# Altium project PPE2.PrjPcb
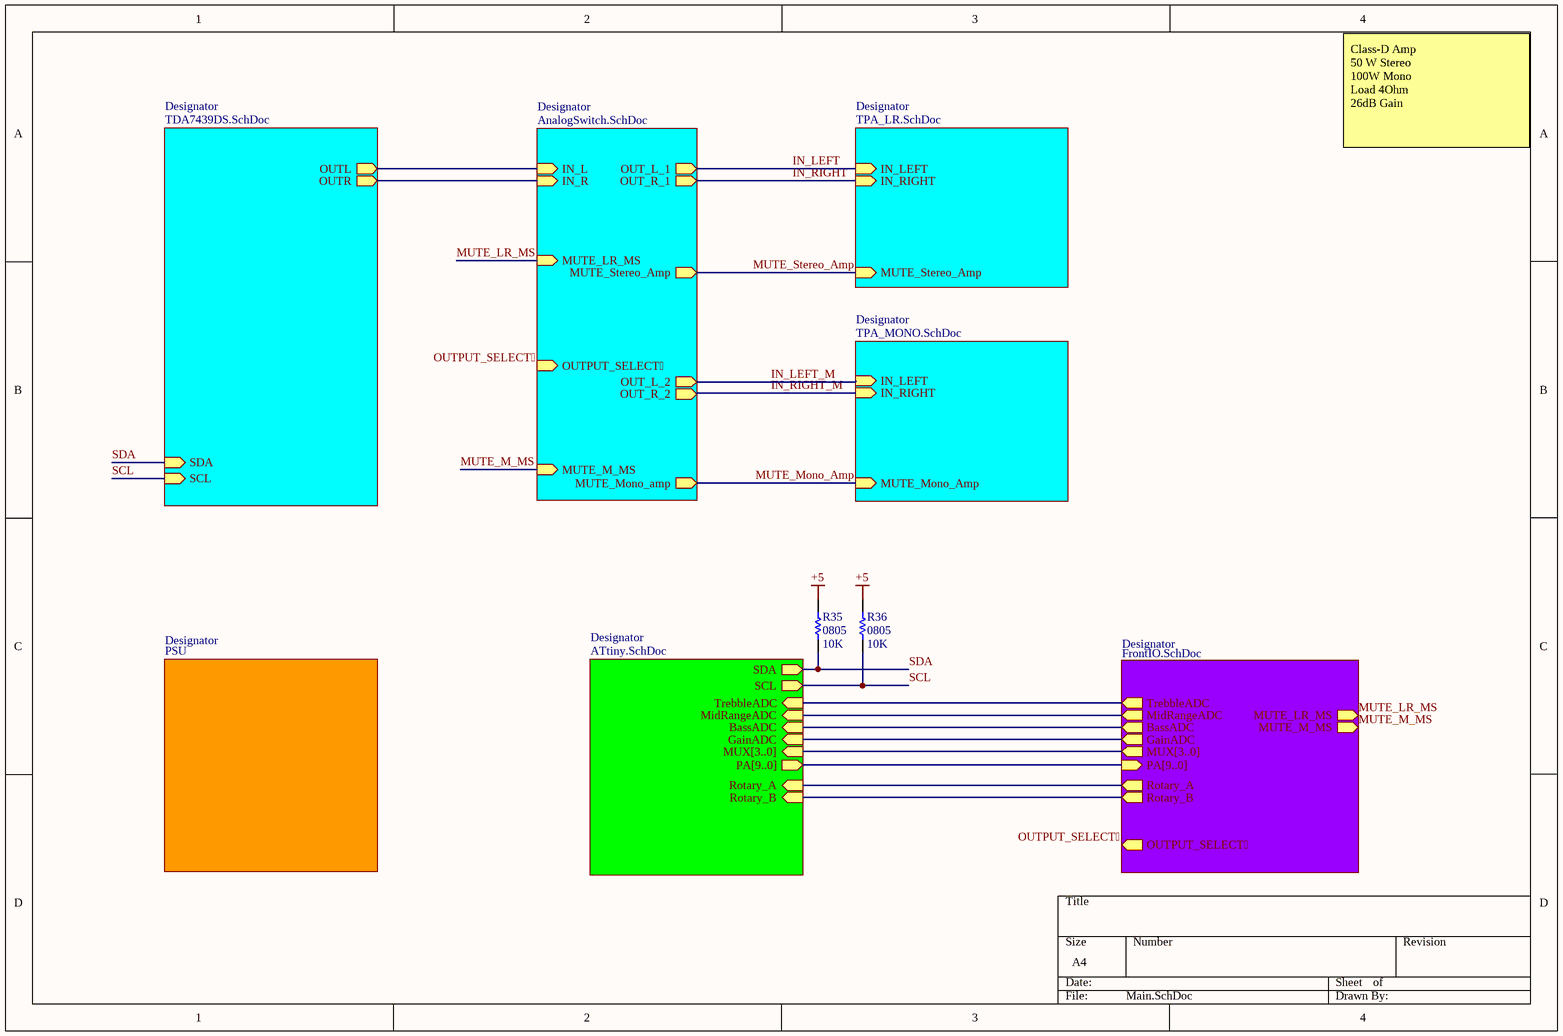
[diagram p0: Main.SchDoc]
8 sheets, 218 parts. Net scope: hierarchical (ports join the sheet entries above them; power ports are global).
Board file: PPE2.PcbDoc
Sheets:
  Main.SchDoc
    Designator = ATtiny.SchDoc
    Designator = TDA7439DS.SchDoc
    Designator = TPA_LR.SchDoc
    Designator = PSU.SchDoc
    Designator = FrontIO.SchDoc
    Designator = TPA_MONO.SchDoc
    Designator = AnalogSwitch.SchDoc

## Sheet Main.SchDoc
size A4; SheetNumber: 1; SheetTotal: 8

### Parts
R35  0805  value 10K  [6-0805_N]
R36  0805  value 10K  [6-0805_N]

### Sub-sheets
Designator = ATtiny.SchDoc: SDA (out), SCL (out), TrebbleADC (in), MidRangeADC (in), BassADC (in), GainADC (in), PA[9..0] (out), Rotary_A (in), Rotary_B (in), MUX[3..0] (in)
Designator = TDA7439DS.SchDoc: SDA (in), SCL (in), OUTL (out), OUTR (out)
Designator = TPA_LR.SchDoc: IN_LEFT (in), IN_RIGHT (in), MUTE_Stereo_Amp (in)
Designator = PSU: no entries
Designator = FrontIO.SchDoc: MidRangeADC (out), TrebbleADC (out), BassADC (out), GainADC (out), Rotary_A (out), Rotary_B (out), PA[9..0] (in), MUX[3..0] (out), MUTE_LR_MS (out), MUTE_M_MS (out), OUTPUT_SELECT (out)
Designator = TPA_MONO.SchDoc: IN_LEFT (in), IN_RIGHT (in), MUTE_Mono_Amp (in)
Designator = AnalogSwitch.SchDoc: IN_L (in), IN_R (in), OUT_L_1 (out), OUT_L_2 (out), OUT_R_1 (out), OUT_R_2 (out), OUTPUT_SELECT (in), MUTE_LR_MS (in), MUTE_M_MS (in), MUTE_Mono_amp (out), MUTE_Stereo_Amp (out)

### Nets
+5: R35.2 R36.2  [project net 5V]
BassADC: sheet Designator/BassADC, sheet Designator/BassADC
GainADC: sheet Designator/GainADC, sheet Designator/GainADC
IN_L: sheet Designator/OUTL, sheet Designator/IN_L
IN_LEFT: sheet Designator/IN_LEFT, sheet Designator/OUT_L_1
IN_LEFT_M: sheet Designator/IN_LEFT, sheet Designator/OUT_L_2
IN_R: sheet Designator/OUTR, sheet Designator/IN_R
IN_RIGHT: sheet Designator/IN_RIGHT, sheet Designator/OUT_R_1
IN_RIGHT_M: sheet Designator/IN_RIGHT, sheet Designator/OUT_R_2
MidRangeADC: sheet Designator/MidRangeADC, sheet Designator/MidRangeADC
MUTE_LR_MS: sheet Designator/MUTE_LR_MS, sheet Designator/MUTE_LR_MS
MUTE_M_MS: sheet Designator/MUTE_M_MS, sheet Designator/MUTE_M_MS
MUTE_Mono_Amp: sheet Designator/MUTE_Mono_Amp, sheet Designator/MUTE_Mono_amp  [project net MUTE_M]
MUTE_Stereo_Amp: sheet Designator/MUTE_Stereo_Amp, sheet Designator/MUTE_Stereo_Amp  [project net MUTE]
OUTPUT_SELECT: sheet Designator/OUTPUT_SELECT, sheet Designator/OUTPUT_SELECT
Rotary_N: sheet Designator/Rotary_B, sheet Designator/Rotary_B
Rotary_P: sheet Designator/Rotary_A, sheet Designator/Rotary_A
SCL: R36.1 ; sheet Designator/SCL, sheet Designator/SCL
SDA: R35.1 ; sheet Designator/SDA, sheet Designator/SDA
TrebbleADC: sheet Designator/TrebbleADC, sheet Designator/TrebbleADC

### Notes on the sheet
- Class-D Amp
  50 W Stereo
  100W Mono
  Load 4Ohm
  26dB Gain

### Library data of the parts
R35 R36 = Res1: Resistor; Published: 8-Jun-2000; LatestRevisionDate: 17-Jul-2002; LatestRevisionNote: Re-released for DXP Platform.; PackageReference: AXIAL-0.3; Publisher: Altium Limited; PackageDescription: Axial Device, Thru-Hole; 2 Leads; 0.3 in Pin Spacing

## Sheet ATtiny.SchDoc
size A4; SheetNumber: 2; SheetTotal: 8
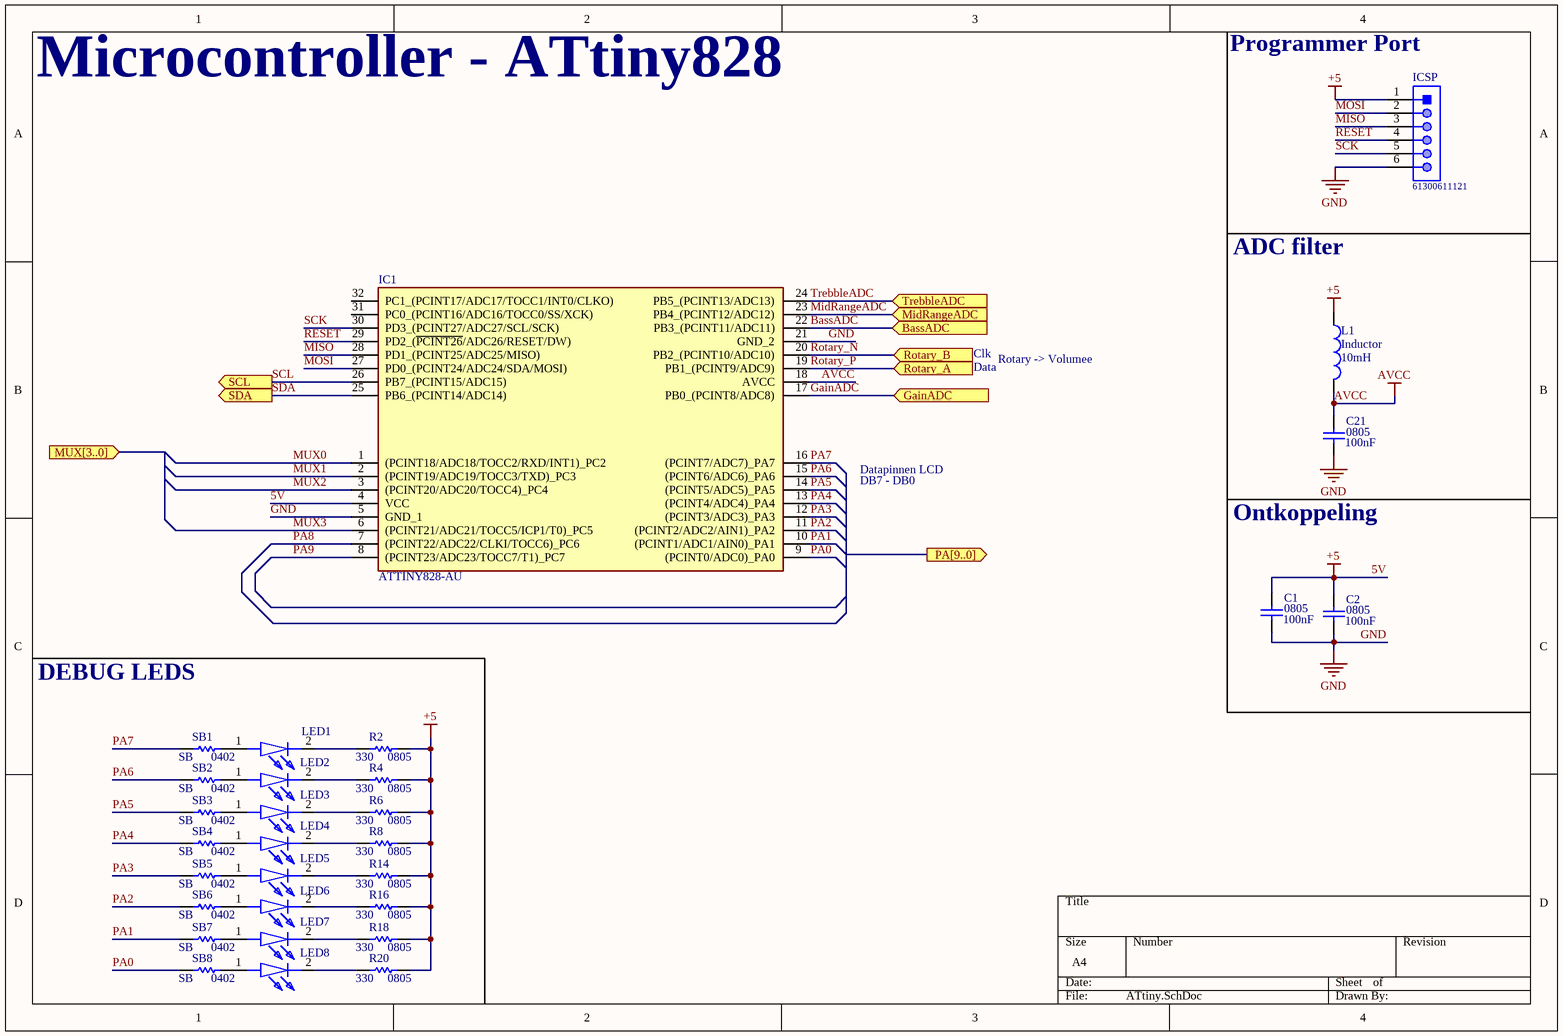
[diagram p1: ATtiny.SchDoc]

### Parts
C1  0805  value 100nF  [6-0805_N]
C2  0805  value 100nF  [6-0805_N]
C21  0805  value 100nF  [6-0805_N]
IC1  ATTINY828-AU  [QFP80P900X900X120-32N]
ICSP  61300611121  [61300611121]
L1  Inductor  value 10mH  [2220]
LED1  ELM70303GD  [ELM70303GD]  (value not drawn)
LED2  ELM70303GD  [ELM70303GD]  (value not drawn)
LED3  ELM70303GD  [ELM70303GD]  (value not drawn)
LED4  ELM70303GD  [ELM70303GD]  (value not drawn)
LED5  ELM70303GD  [ELM70303GD]  (value not drawn)
LED6  ELM70303GD  [ELM70303GD]  (value not drawn)
LED7  ELM70303GD  [ELM70303GD]  (value not drawn)
LED8  ELM70303GD  [ELM70303GD]  (value not drawn)
R2  0805  value 330  [6-0805_N]
R4  0805  value 330  [6-0805_N]
R6  0805  value 330  [6-0805_N]
R8  0805  value 330  [6-0805_N]
R14  0805  value 330  [6-0805_N]
R16  0805  value 330  [6-0805_N]
R18  0805  value 330  [6-0805_N]
R20  0805  value 330  [6-0805_N]
SB1  0402  value SB  [0402]
SB2  0402  value SB  [0402]
SB3  0402  value SB  [0402]
SB4  0402  value SB  [0402]
SB5  0402  value SB  [0402]
SB6  0402  value SB  [0402]
SB7  0402  value SB  [0402]
SB8  0402  value SB  [0402]

### Ports
BassADC (in, see Main[3C], FrontIO[4A]), GainADC (in, see Main[3C], FrontIO[4B]), MidRangeADC (in, see Main[3C], FrontIO[4A]), MUX[3..0] (in, see Main[3C], FrontIO[2A]), PA[9..0] (out, see Main[3C], FrontIO[1B]), Rotary_A (in, see Main[3D], FrontIO[3B]), Rotary_B (in, see Main[3D], FrontIO[3B]), SCL (out, see Main[3C], TDA7439DS[2B]), SDA (out, see Main[3C], TDA7439DS[2B]), TrebbleADC (in, see Main[3C], FrontIO[3A])

### Nets
5V: C1.1 C2.1 IC1.4(VCC) ICSP.1 L1.1 R2.1 R4.1 R6.1 R8.1 R14.1 R16.1 R18.1 R20.1  [also labelled +5]
AVCC: C21.1 IC1.18(AVCC) L1.2
GND: C1.2 C2.2 C21.2 IC1.5(GND_1) IC1.21(GND_2) ICSP.6
BassADC: IC1.22(PB3_(PCINT11/ADC11)) ; port BassADC
GainADC: IC1.17(PB0_(PCINT8/ADC8)) ; port GainADC
MidRangeADC: IC1.23(PB4_(PCINT12/ADC12)) ; port MidRangeADC
MISO: IC1.28(PD1_(PCINT25/ADC25/MISO)) ICSP.3
MOSI: IC1.27(PD0_(PCINT24/ADC24/SDA/MOSI)) ICSP.2
MUX0: IC1.1((PCINT18/ADC18/TOCC2/RXD/INT1)_PC2)
MUX1: IC1.2((PCINT19/ADC19/TOCC3/TXD)_PC3)
MUX2: IC1.3((PCINT20/ADC20/TOCC4)_PC4)
MUX3: IC1.6((PCINT21/ADC21/TOCC5/ICP1/T0)_PC5)
PA0: IC1.9((PCINT0/ADC0)_PA0) SB8.2
PA1: IC1.10((PCINT1/ADC1/AIN0)_PA1) SB7.2
PA2: IC1.11((PCINT2/ADC2/AIN1)_PA2) SB6.2
PA3: IC1.12((PCINT3/ADC3)_PA3) SB5.2
PA4: IC1.13((PCINT4/ADC4)_PA4) SB4.2
PA5: IC1.14((PCINT5/ADC5)_PA5) SB3.2
PA6: IC1.15((PCINT6/ADC6)_PA6) SB2.2
PA7: IC1.16((PCINT7/ADC7)_PA7) SB1.2
PA8: IC1.7((PCINT22/ADC22/CLKI/TOCC6)_PC6)
PA9: IC1.8((PCINT23/ADC23/TOCC7/T1)_PC7)
RESET: IC1.29(PD2_(~{PCINT26}/ADC26/RESET/DW)) ICSP.4
Rotary_N: IC1.20(PB2_(PCINT10/ADC10)) ; port Rotary_B
Rotary_P: IC1.19(PB1_(PCINT9/ADC9)) ; port Rotary_A
SCK: IC1.30(PD3_(PCINT27/ADC27/SCL/SCK)) ICSP.5
SCL: IC1.26(PB7_(PCINT15/ADC15)) ; port SCL
SDA: IC1.25(PB6_(PCINT14/ADC14)) ; port SDA
TrebbleADC: IC1.24(PB5_(PCINT13/ADC13)) ; port TrebbleADC
NetLED1_1: LED1.1(A) SB1.1
NetLED1_2: LED1.2(K) R2.2
NetLED2_1: LED2.1(A) SB2.1
NetLED2_2: LED2.2(K) R4.2
NetLED3_1: LED3.1(A) SB3.1
NetLED3_2: LED3.2(K) R6.2
NetLED4_1: LED4.1(A) SB4.1
NetLED4_2: LED4.2(K) R8.2
NetLED5_1: LED5.1(A) SB5.1
NetLED5_2: LED5.2(K) R14.2
NetLED6_1: LED6.1(A) SB6.1
NetLED6_2: LED6.2(K) R16.2
NetLED7_1: LED7.1(A) SB7.1
NetLED7_2: LED7.2(K) R18.2
NetLED8_1: LED8.1(A) SB8.1
NetLED8_2: LED8.2(K) R20.2

Not connected (* = marked no-connect by the designer): IC1 31(PC0_(PCINT16/ADC16/TOCC0/SS/XCK)) 32(PC1_(PCINT17/ADC17/TOCC1/INT0/CLKO))

### Notes on the sheet
- Microcontroller - ATtiny828
- (near ICSP) Programmer Port
- ADC filter
- Clk
- Data <Clk>
- Rotary -> Volumee
- Datapinnen LCD
- DB7 - DB0
- Ontkoppeling
- DEBUG LEDS

### Library data of the parts
C1 C2 C21 = Cap: Capacitor; Published: 8-Jun-2000; LatestRevisionDate: 17-Jul-2002; LatestRevisionNote: Re-released for DXP Platform.; PackageReference: RAD-0.3; Publisher: Altium Limited; PackageDescription: Radial Cap, Thru-Hole; 2 Leads; 0.3 in Pin Spacing
IC1 = ATTINY828-AU: Integrated Circuit; Manufacturer_Name: Microchip; Datasheet Link: http://ww1.microchip.com/downloads/en/DeviceDoc/doc8371.pdf; Height: 1.2mm; Manufacturer_Part_Number: ATTINY828-AU
ICSP = CMP-1502-01070-1: THT Vertical Pin Header WR-PHD, Pitch 2.54 mm, Single Row, 6 pins; Manufacturer: Wurth Elektronik; Gender: Male; Pin Number: 6; Pitch: 2.54mm; Working Voltage: 250VAC; Rated Current: 3A; Withstanding Voltage: 500VAC; Contact Resistance: 20mOhm; Operating Temperature: -40to105degC; Packaging: Bag; Datasheet URL: https://katalog.we-online.de/em/datasheet/6130xx11121.pdf; Package Reference: 61300611121; Mounting Technology: THT; Publisher: WurthElektronik; Part Number: 61300611121; Manufacturer URL: http://www.we-online.de; Row Number: Single; Orientation: Vertical
L1 = Inductor: Code_IEC: 1005; Published: 8-Jun-2000; LatestRevisionDate: 29-May-2009; LatestRevisionNote: IPC-7351 Footprint Added.; PackageReference: 0402-A; Publisher: Altium Limited; PackageDescription: Chip Inductor; Code_JEITA: 0402
LED1-LED8 = ELM70303GD: LED; Manufacturer_Name: Bivar; Datasheet Link: https://componentsearchengine.com/Datasheets/2/ELM70303GD.pdf; Height: 5.4mm; Manufacturer_Part_Number: ELM70303GD; Mouser Part Number: 749-ELM70303GD; Mouser Price/Stock: https://www.mouser.co.uk/ProductDetail/Bivar/ELM70303GD?qs=RaByzyhmEWg099B9bvH9wg%3D%3D
R2 R4 R6 R8 R14 R16 R18 R20 SB1-SB8 = Res1: Resistor; Published: 8-Jun-2000; LatestRevisionDate: 17-Jul-2002; LatestRevisionNote: Re-released for DXP Platform.; PackageReference: AXIAL-0.3; Publisher: Altium Limited; PackageDescription: Axial Device, Thru-Hole; 2 Leads; 0.3 in Pin Spacing

## Sheet TDA7439DS.SchDoc
size A4; SheetNumber: 3; SheetTotal: 8
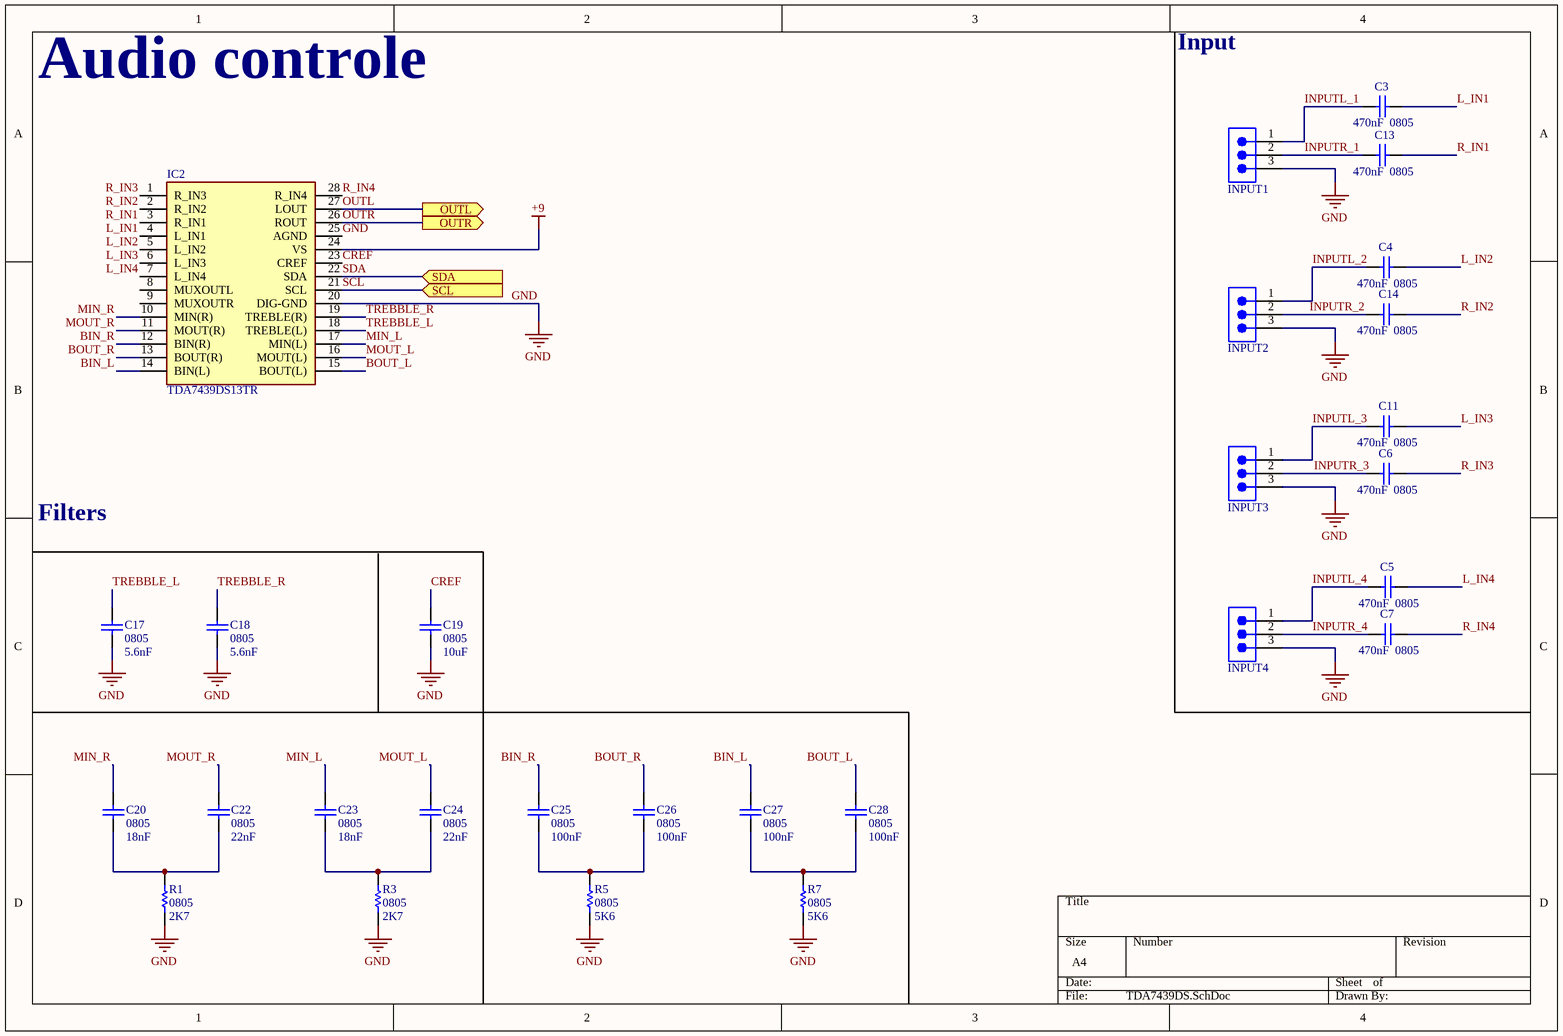
[diagram p2: TDA7439DS.SchDoc]

### Parts
C3  0805  value 470nF  [6-0805_N]
C4  0805  value 470nF  [6-0805_N]
C5  0805  value 470nF  [6-0805_N]
C6  0805  value 470nF  [6-0805_N]
C7  0805  value 470nF  [6-0805_N]
C11  0805  value 470nF  [6-0805_N]
C13  0805  value 470nF  [6-0805_N]
C14  0805  value 470nF  [6-0805_N]
C17  0805  value 5.6nF  [6-0805_N]
C18  0805  value 5.6nF  [6-0805_N]
C19  0805  value 10uF  [6-0805_N]
C20  0805  value 18nF  [6-0805_N]
C22  0805  value 22nF  [6-0805_N]
C23  0805  value 18nF  [6-0805_N]
C24  0805  value 22nF  [6-0805_N]
C25  0805  value 100nF  [6-0805_N]
C26  0805  value 100nF  [6-0805_N]
C27  0805  value 100nF  [6-0805_N]
C28  0805  value 100nF  [6-0805_N]
IC2  TDA7439DS13TR  [SOIC127P1032X265-28N]
INPUT1  TSW-103-07-F-S  [SMTC-TSW-103-07-X-S]  (value not drawn)
INPUT2  TSW-103-07-F-S  [SMTC-TSW-103-07-X-S]  (value not drawn)
INPUT3  TSW-103-07-F-S  [SMTC-TSW-103-07-X-S]  (value not drawn)
INPUT4  TSW-103-07-F-S  [SMTC-TSW-103-07-X-S]  (value not drawn)
R1  0805  value 2K7  [6-0805_N]
R3  0805  value 2K7  [6-0805_N]
R5  0805  value 5K6  [6-0805_N]
R7  0805  value 5K6  [6-0805_N]

### Ports
OUTL (out, see Main[1A]), OUTR (out, see Main[1A]), SCL (in, see Main[1B], ATtiny[1B]), SDA (in, see Main[1B], ATtiny[1B])

### Nets
+9: IC2.24(VS)
GND: C17.2 C18.2 C19.2 IC2.20(DIG-GND) IC2.25(AGND) INPUT1.3 INPUT2.3 INPUT3.3 INPUT4.3 R1.1 R3.1 R5.1 R7.1
BIN_L: C27.1 IC2.14(BIN(L))
BIN_R: C25.1 IC2.12(BIN(R))
BOUT_L: C28.1 IC2.15(BOUT(L))
BOUT_R: C26.1 IC2.13(BOUT(R))
CREF: C19.1 IC2.23(CREF)
INPUTL_1: C3.1 INPUT1.1
INPUTL_2: C4.1 INPUT2.1
INPUTL_3: C11.1 INPUT3.1
INPUTL_4: C5.1 INPUT4.1
INPUTR_1: C13.1 INPUT1.2
INPUTR_2: C14.1 INPUT2.2
INPUTR_3: C6.1 INPUT3.2
INPUTR_4: C7.1 INPUT4.2
L_IN1: C3.2 IC2.4(L_IN1)
L_IN2: C4.2 IC2.5(L_IN2)
L_IN3: C11.2 IC2.6(L_IN3)
L_IN4: C5.2 IC2.7(L_IN4)
MIN_L: C23.1 IC2.17(MIN(L))
MIN_R: C20.1 IC2.10(MIN(R))
MOUT_L: C24.1 IC2.16(MOUT(L))
MOUT_R: C22.1 IC2.11(MOUT(R))
OUTL: IC2.27(LOUT) ; port OUTL  [project net IN_L]
OUTR: IC2.26(ROUT) ; port OUTR  [project net IN_R]
R_IN1: C13.2 IC2.3(R_IN1)
R_IN2: C14.2 IC2.2(R_IN2)
R_IN3: C6.2 IC2.1(R_IN3)
R_IN4: C7.2 IC2.28(R_IN4)
SCL: IC2.21(SCL) ; port SCL
SDA: IC2.22(SDA) ; port SDA
TREBBLE_L: C17.1 IC2.18(TREBLE(L))
TREBBLE_R: C18.1 IC2.19(TREBLE(R))
NetC20_2: C20.2 C22.2 R1.2
NetC23_2: C23.2 C24.2 R3.2
NetC25_2: C25.2 C26.2 R5.2
NetC27_2: C27.2 C28.2 R7.2

Not connected (* = marked no-connect by the designer): IC2 8(MUXOUTL) 9(MUXOUTR)

### Notes on the sheet
- Audio controle
- Input
- Filters

### Library data of the parts
C3-C7 C11 C13 C14 C17-C20 C22-C28 = Cap: Capacitor; Published: 8-Jun-2000; LatestRevisionDate: 17-Jul-2002; LatestRevisionNote: Re-released for DXP Platform.; PackageReference: RAD-0.3; Publisher: Altium Limited; PackageDescription: Radial Cap, Thru-Hole; 2 Leads; 0.3 in Pin Spacing
IC2 = TDA7439DS13TR: Integrated Circuit; Manufacturer_Name: STMicroelectronics; Datasheet Link: https://componentsearchengine.com//TDA7439DS13TR.pdf; Height: 2.65mm; Mouser2 Part Number: 511-TDA7439DS13TR; Mouser2 Price/Stock: https://www.mouser.com/Search/Refine.aspx?Keyword=511-TDA7439DS13TR; Manufacturer_Part_Number: TDA7439DS13TR
INPUT1-INPUT4 = CMP-1024-00331-1: 0.025" SQ Post Header, Through-hole, Vertical, -55 to 125 degC, 2.54 mm Pitch, 3-Pin, Male, RoHS; Manufacturer: Samtec; Pitch: 2.54 mm; DatasheetVersion: F-214; ComponentLink1Description: Manufacturer URL; ComponentLink3URL: http://www.samtec.com/documents/webfiles/cpdf/TSW-XXX-XX-XXX-X-XX-XXX-MKT.pdf; Mounting Technology: Through-hole; PackageDescription: .025[0.64] SQ. Post Terminal Strip Assembly; Temperature Range: -55 to 125 degC; ComponentLink3Description: Package Specification; Orientation: Vertical; PartNumber: TSW-103-07-F-S; RoHS: True; PackageVersion: DM, 8/1988; ComponentLink2Description: Datasheet; ComponentLink1URL: http://www.samtec.com; ComponentLink2URL: http://www.samtec.com/documents/webfiles/pdf/TSW_TH.PDF; PackageReference: TSW-103-07-X-S
R1 R3 R5 R7 = Res1: Resistor; Published: 8-Jun-2000; LatestRevisionDate: 17-Jul-2002; LatestRevisionNote: Re-released for DXP Platform.; PackageReference: AXIAL-0.3; Publisher: Altium Limited; PackageDescription: Axial Device, Thru-Hole; 2 Leads; 0.3 in Pin Spacing

## Sheet TPA_LR.SchDoc
size A4; SheetNumber: 4; SheetTotal: 8
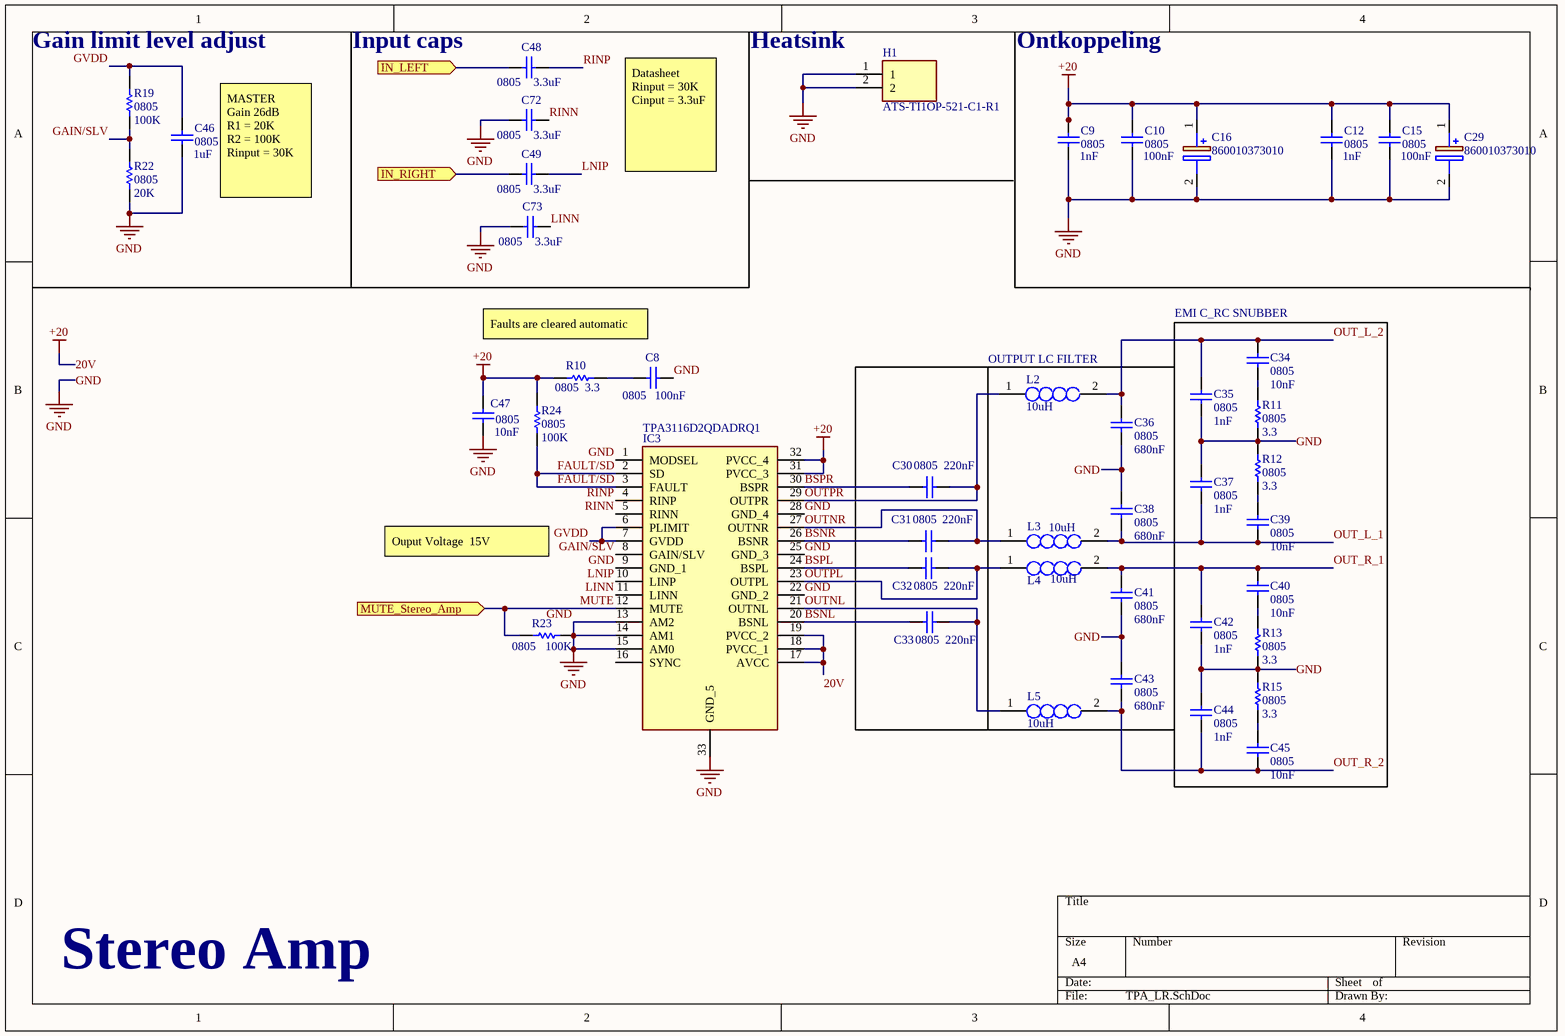
[diagram p3: TPA_LR.SchDoc]

### Parts
C8  0805  value 100nF  [6-0805_N]
C9  0805  value 1nF  [6-0805_N]
C10  0805  value 100nF  [6-0805_N]
C12  0805  value 1nF  [6-0805_N]
C15  0805  value 100nF  [6-0805_N]
C16  860010373010  [CAPPRD250W52D630H1250]
C29  860010373010  [CAPPRD250W52D630H1250]
C30  0805  value 220nF  [6-0805_N]
C31  0805  value 220nF  [6-0805_N]
C32  0805  value 220nF  [6-0805_N]
C33  0805  value 220nF  [6-0805_N]
C34  0805  value 10nF  [6-0805_N]
C35  0805  value 1nF  [6-0805_N]
C36  0805  value 680nF  [6-0805_N]
C37  0805  value 1nF  [6-0805_N]
C38  0805  value 680nF  [6-0805_N]
C39  0805  value 10nF  [6-0805_N]
C40  0805  value 10nF  [6-0805_N]
C41  0805  value 680nF  [6-0805_N]
C42  0805  value 1nF  [6-0805_N]
C43  0805  value 680nF  [6-0805_N]
C44  0805  value 1nF  [6-0805_N]
C45  0805  value 10nF  [6-0805_N]
C46  0805  value 1uF  [6-0805_N]
C47  0805  value 10nF  [6-0805_N]
C48  0805  value 3.3uF  [6-0805_N]
C49  0805  value 3.3uF  [6-0805_N]
C72  0805  value 3.3uF  [6-0805_N]
C73  0805  value 3.3uF  [6-0805_N]
H1  ATS-TI1OP-521-C1-R1  [ATSTI1OP521C1R1]
IC3  TPA3116D2QDADRQ1  [SOP65P810X120-33N]
L2  10uH  [INDPM110100X400N]
L3  10uH  [INDPM110100X400N]
L4  10uH  [INDPM110100X400N]
L5  10uH  [INDPM110100X400N]
R10  0805  value 3.3  [6-0805_N]
R11  0805  value 3.3  [6-0805_N]
R12  0805  value 3.3  [6-0805_N]
R13  0805  value 3.3  [6-0805_N]
R15  0805  value 3.3  [6-0805_N]
R19  0805  value 100K  [6-0805_N]
R22  0805  value 20K  [6-0805_N]
R23  0805  value 100K  [6-0805_N]
R24  0805  value 100K  [6-0805_N]

### Blocks framed on the sheet
EMI C_RC SNUBBER: C34 C35 C37 C39 C40 C42 C44 C45 R11-R13 R15
OUTPUT LC FILTER: C30-C33

### Ports
IN_LEFT (in, see Main[3A]), IN_RIGHT (in, see Main[3A]), MUTE_Stereo_Amp (in, see Main[3B], AnalogSwitch[3B])

### Nets
20V: C9.1 C10.1 C12.1 C15.1 C16.1(+) C29.1(+) C47.1 IC3.17(AVCC) IC3.18(PVCC_1) IC3.19(PVCC_2) IC3.31(PVCC_3) IC3.32(PVCC_4) R10.2 R24.2  [also labelled +20]
GND: C8.2 C9.2 C10.2 C12.2 C15.2 C16.2(-) C29.2(-) C35.1 C36.1 C37.2 C38.2 C41.1 C42.1 C43.2 C44.2 C46.2 C47.2 C72.1 C73.1 H1.1 H1.2 IC3.1(MODSEL) IC3.9(GND_1) IC3.13(AM2) IC3.14(AM1) IC3.15(AM0) IC3.22(GND_2) IC3.25(GND_3) IC3.28(GND_4) IC3.33(GND_5) R11.1 R12.2 R13.1 R15.2 R22.1 R23.1
BSNL: C33.1 IC3.20(BSNL)
BSNR: C31.1 IC3.26(BSNR)
BSPL: C32.1 IC3.24(BSPL)
BSPR: C30.1 IC3.30(BSPR)
FAULT/SD: IC3.2(SD) IC3.3(FAULT) R24.1
GAIN/SLV: IC3.8(GAIN/SLV) R19.1 R22.2
GVDD: C46.1 IC3.6(PLIMIT) IC3.7(GVDD) R19.2
IN_LEFT: C48.1 ; port IN_LEFT
IN_RIGHT: C49.1 ; port IN_RIGHT
LINN: C73.2 IC3.11(LINN)
LNIP: C49.2 IC3.10(LINP)
MUTE: IC3.12(MUTE) R23.2 ; port MUTE_Stereo_Amp
OUT_L_1: C37.1 C38.1 C39.1 L3.2
OUT_L_2: C34.2 C35.2 C36.2 L2.2
OUT_R_1: C40.2 C41.2 C42.2 L4.2
OUT_R_2: C43.1 C44.1 C45.1 L5.2
OUTNL: C33.2 IC3.21(OUTNL) L5.1
OUTNR: C31.2 IC3.27(OUTNR) L3.1
OUTPL: C32.2 IC3.23(OUTPL) L4.1
OUTPR: C30.2 IC3.29(OUTPR) L2.1
RINN: C72.2 IC3.5(RINN)
RINP: C48.2 IC3.4(RINP)
NetC8_1: C8.1 R10.1
NetC34_1: C34.1 R11.2
NetC39_2: C39.2 R12.1
NetC40_1: C40.1 R13.2
NetC45_2: C45.2 R15.1

Not connected (* = marked no-connect by the designer): IC3 16(SYNC)

### Notes on the sheet
- (near R19) Gain limit level adjust
- (near C48) Input caps
- (near H1) Heatsink
- Ontkoppeling
- Datasheet
  Rinput = 30K
  Cinput = 3.3uF
- (near C46) MASTER
  Gain 26dB
  R1 = 20K
  R2 = 100K
  Rinput = 30K
- Faults are cleared automatic
- Ouput Voltage  15V
- Stereo Amp

### Library data of the parts
C8-C10 C12 C15 C30-C49 C72 C73 = Cap: Capacitor; Published: 8-Jun-2000; LatestRevisionDate: 17-Jul-2002; LatestRevisionNote: Re-released for DXP Platform.; PackageReference: RAD-0.3; Publisher: Altium Limited; PackageDescription: Radial Cap, Thru-Hole; 2 Leads; 0.3 in Pin Spacing
C16 C29 = 860010373010: Capacitor Polarised; Manufacturer_Name: Wurth Elektronik; Datasheet Link: https://ms.componentsearchengine.com/Datasheets/2/860010373010.pdf; Height: 12.5mm; Manufacturer_Part_Number: 860010373010; Mouser Part Number: 710-860010373010; Mouser Price/Stock: https://www.mouser.com/Search/Refine.aspx?Keyword=710-860010373010
H1 = ATS-TI1OP-521-C1-R1: Hardware; Manufacturer_Name: ADVANCED THERMAL SOLUTIONS; Datasheet Link: https://media.digikey.com/pdf/Data%20Sheets/Advanced%20Thermal%20Solutions%20PDFs/ATS-TI10P-521-C1-R1.pdf; Height: 28mm; Manufacturer_Part_Number: ATS-TI1OP-521-C1-R1; Mouser Part Number: 984-ATS-TI1OP521C1R1; Mouser Price/Stock: https://www.mouser.co.uk/ProductDetail/Advanced-Thermal-Solutions/ATS-TI1OP-521-C1-R1?qs=MLItCLRbWsx43HjcCreTeQ%3D%3D; Arrow Part Number: ATS-TI1OP-521-C1-R1; Arrow Price/Stock: https://www.arrow.com/en/products/ats-ti1op-521-c1-r1/advanced-thermal-solutions?region=europe
IC3 = TPA3116D2QDADRQ1: Integrated Circuit; Manufacturer_Name: Texas Instruments; Datasheet Link: http://www.ti.com/lit/gpn/tpa3116d2-q1; Height: 1.2mm; Manufacturer_Part_Number: TPA3116D2QDADRQ1; Mouser Part Number: 595-TPA3116D2QDADRQ1; Mouser Price/Stock: https://www.mouser.co.uk/ProductDetail/Texas-Instruments/TPA3116D2QDADRQ1?qs=UPLqB4C8V4HphPtdRa3LzQ%3D%3D; Arrow Part Number: TPA3116D2QDADRQ1; Arrow Price/Stock: https://www.arrow.com/en/products/tpa3116d2qdadrq1/texas-instruments?region=nac
L2-L5 = SRP1038A-4R7M: Inductor; Manufacturer_Name: Bourns; Datasheet Link: http://uk.rs-online.com/web/p/products/8193346; Height: 4mm; Manufacturer_Part_Number: SRP1038A-4R7M; Mouser Part Number: 652-SRP1038A-4R7M; Mouser Price/Stock: https://www.mouser.co.uk/ProductDetail/Bourns/SRP1038A-4R7M/?qs=7z%252BmIopC6%2FImcvZmY6cLew%3D%3D; Arrow Part Number: SRP1038A-4R7M; Arrow Price/Stock: https://www.arrow.com/en/products/srp1038a-4r7m/bourns?region=nac
R10-R13 R15 R19 R22-R24 = Res1: Resistor; Published: 8-Jun-2000; LatestRevisionDate: 17-Jul-2002; LatestRevisionNote: Re-released for DXP Platform.; PackageReference: AXIAL-0.3; Publisher: Altium Limited; PackageDescription: Axial Device, Thru-Hole; 2 Leads; 0.3 in Pin Spacing

## Sheet PSU.SchDoc
size A4; SheetNumber: 5; SheetTotal: 8
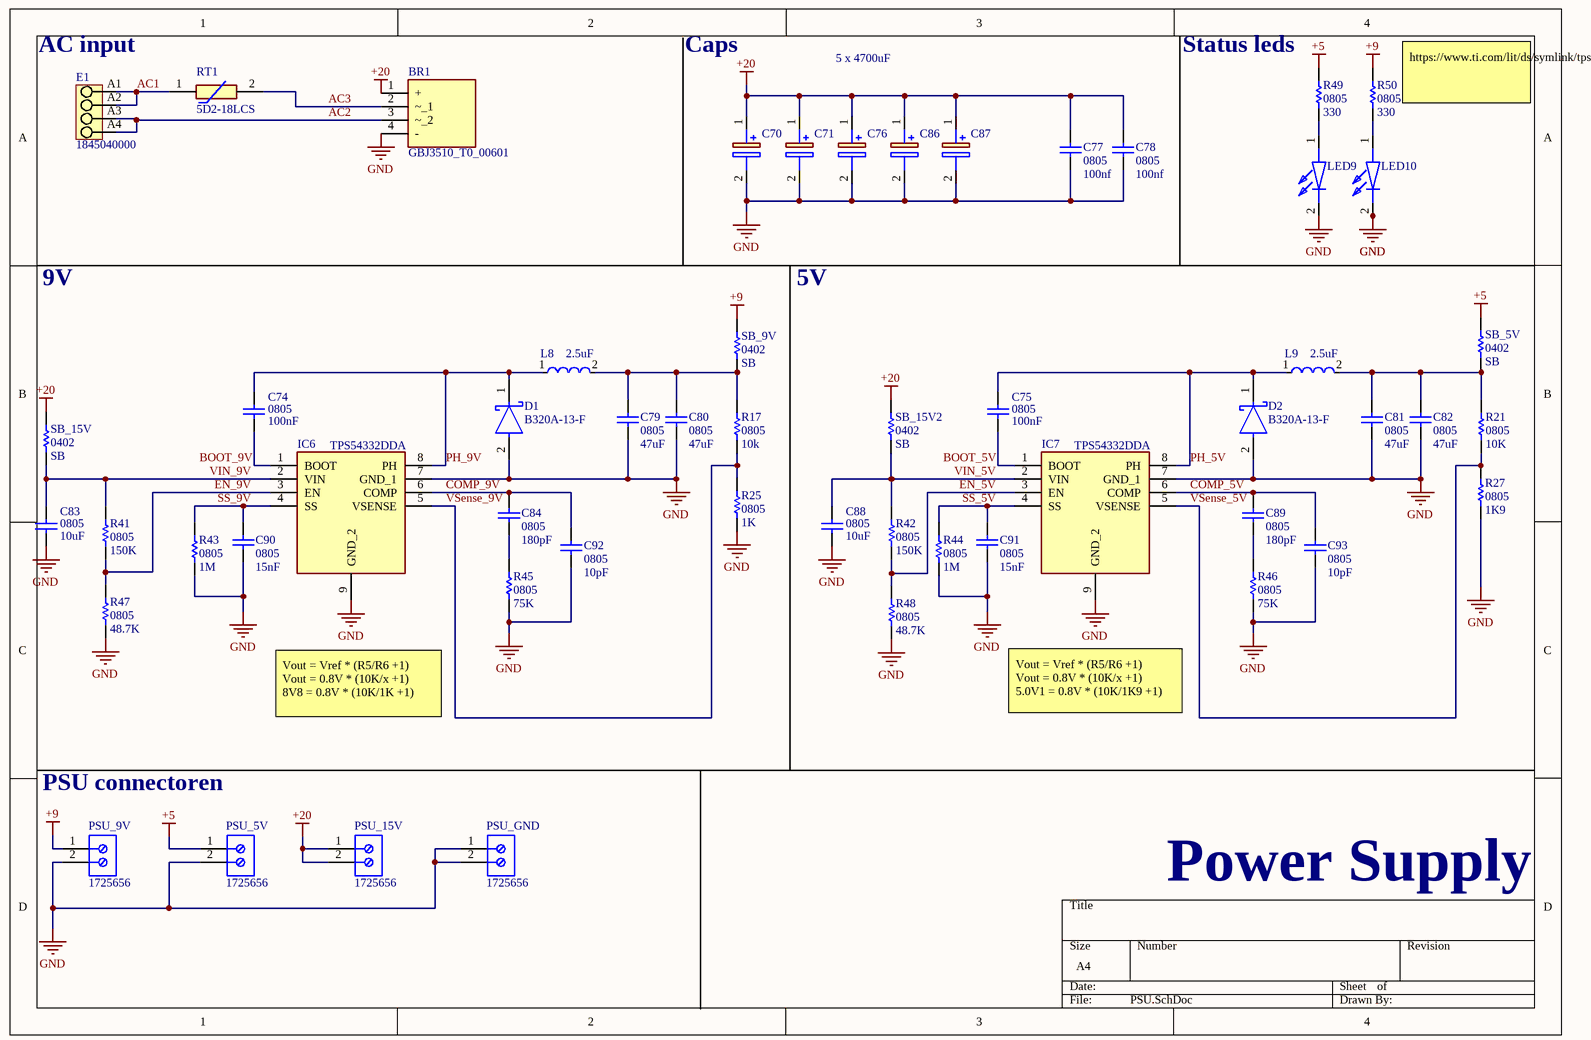
[diagram p4: PSU.SchDoc]

### Parts
BR1  GBJ3510_T0_00601  [GBJ3510_T0_00601]
C70  UFW1V472MHD  [CAPPRD750W80D1825H3750]  (value not drawn)
C71  UFW1V472MHD  [CAPPRD750W80D1825H3750]  (value not drawn)
C74  0805  value 100nF  [6-0805_N]
C75  0805  value 100nF  [6-0805_N]
C76  UFW1V472MHD  [CAPPRD750W80D1825H3750]  (value not drawn)
C77  0805  value 100nf  [6-0805_N]
C78  0805  value 100nf  [6-0805_N]
C79  0805  value 47uF  [6-0805_N]
C80  0805  value 47uF  [6-0805_N]
C81  0805  value 47uF  [6-0805_N]
C82  0805  value 47uF  [6-0805_N]
C83  0805  value 10uF  [6-0805_N]
C84  0805  value 180pF  [6-0805_N]
C86  UFW1V472MHD  [CAPPRD750W80D1825H3750]  (value not drawn)
C87  UFW1V472MHD  [CAPPRD750W80D1825H3750]  (value not drawn)
C88  0805  value 10uF  [6-0805_N]
C89  0805  value 180pF  [6-0805_N]
C90  0805  value 15nF  [6-0805_N]
C91  0805  value 15nF  [6-0805_N]
C92  0805  value 10pF  [6-0805_N]
C93  0805  value 10pF  [6-0805_N]
D1  B320A-13-F  [FP-SMA-MFG]
D2  B320A-13-F  [FP-SMA-MFG]
E1  1845040000  [LM_3_5_90_04]
IC6  TPS54332DDA  [SOIC127P600X170-9N]
IC7  TPS54332DDA  [SOIC127P600X170-9N]
L8  2.5uF  [710-74437346025]
L9  2.5uF  [710-74437346025]
LED9  ELM70303GD  [ELM70303GD]  (value not drawn)
LED10  ELM70303GD  [ELM70303GD]  (value not drawn)
PSU_5V  1725656  [PHOE-1725656-2]
PSU_9V  1725656  [PHOE-1725656-2]
PSU_15V  1725656  [PHOE-1725656-2]
PSU_GND  1725656  [PHOE-1725656-2]
R17  0805  value 10k  [6-0805_N]
R21  0805  value 10K  [6-0805_N]
R25  0805  value 1K  [6-0805_N]
R27  0805  value 1K9  [6-0805_N]
R41  0805  value 150K  [6-0805_N]
R42  0805  value 150K  [6-0805_N]
R43  0805  value 1M  [6-0805_N]
R44  0805  value 1M  [6-0805_N]
R45  0805  value 75K  [6-0805_N]
R46  0805  value 75K  [6-0805_N]
R47  0805  value 48.7K  [6-0805_N]
R48  0805  value 48.7K  [6-0805_N]
R49  0805  value 330  [6-0805_N]
R50  0805  value 330  [6-0805_N]
RT1  5D2-18LCS  [5D218LCS]
SB_5V  0402  value SB  [0402]
SB_9V  0402  value SB  [0402]
SB_15V  0402  value SB  [0402]
SB_15V2  0402  value SB  [0402]

### Nets
+5: PSU_5V.1 R49.1 SB_5V.1  [project net 5V]
+9: PSU_9V.1 R50.1 SB_9V.2
+20: BR1.1(+) C70.1(+) C71.1(+) C76.1(+) C77.1 C78.1 C86.1(+) C87.1(+) PSU_15V.1 PSU_15V.2 SB_15V.1 SB_15V2.2  [project net 20V]
GND: BR1.4(-) C70.2(-) C71.2(-) C76.2(-) C77.2 C78.2 C79.1 C80.1 C81.1 C82.1 C83.1 C86.2(-) C87.2(-) C88.1 C90.1 C91.1 C92.1 C93.1 D1.2(A) D2.2(A) IC6.7(GND_1) IC6.9(GND_2) IC7.7(GND_1) IC7.9(GND_2) LED9.2(K) LED10.2(K) PSU_5V.2 PSU_9V.2 PSU_GND.1 PSU_GND.2 R25.2 R27.2 R43.2 R44.2 R45.2 R46.2 R47.2 R48.2
AC1: E1.A1 E1.A2 RT1.1
AC2: BR1.3(~_2) E1.A3 E1.A4
AC3: BR1.2(~_1) RT1.2
BOOT_5V: C75.1 IC7.1(BOOT)
BOOT_9V: C74.1 IC6.1(BOOT)
COMP_5V: C89.2 C93.2 IC7.6(COMP)
COMP_9V: C84.2 C92.2 IC6.6(COMP)
EN_5V: IC7.3(EN) R42.2 R48.1
EN_9V: IC6.3(EN) R41.2 R47.1
PH_5V: C75.2 D2.1(C) IC7.8(PH) L9.1
PH_9V: C74.2 D1.1(C) IC6.8(PH) L8.1
SS_5V: C91.2 IC7.4(SS) R44.1
SS_9V: C90.2 IC6.4(SS) R43.1
VIN_5V: C88.2 IC7.2(VIN) R42.1 SB_15V2.1
VIN_9V: C83.2 IC6.2(VIN) R41.1 SB_15V.2
VSense_5V: IC7.5(VSENSE) R21.2 R27.1
VSense_9V: IC6.5(VSENSE) R17.2 R25.1
NetC79_2: C79.2 C80.2 L8.2 R17.1 SB_9V.1
NetC81_2: C81.2 C82.2 L9.2 R21.1 SB_5V.2
NetC84_1: C84.1 R45.1
NetC89_1: C89.1 R46.1
NetLED9_1: LED9.1(A) R49.2
NetLED10_1: LED10.1(A) R50.2

### Notes on the sheet
- (near E1) AC input
- Caps
- 5 x 4700uF
- (near R49) Status leds
- (near R50) https://www.ti.com/lit/ds/symlink/tps54332.pdf?HQS=dis-mous-null-mousermode-dsf-pf-null-wwe&ts=1676549637763&ref_url=https%253A%252F%252Fwww.mouser.de%252F
- 9V
- 5V
- Vout = Vref * (R5/R6 +1)
  Vout = 0.8V * (10K/x +1)
  8V8 = 0.8V * (10K/1K +1)
- Vout = Vref * (R5/R6 +1)
  Vout = 0.8V * (10K/x +1)
  5.0V1 = 0.8V * (10K/1K9 +1)
- PSU connectoren
- Power Supply

### Library data of the parts
BR1 = GBJ3510_T0_00601: Bridge Rectifier; Manufacturer_Name: PANJIT; Datasheet Link: https://www.panjit.com.tw/upload/datasheet/GBJ3510.pdf; Height: 24.6mm; Manufacturer_Part_Number: GBJ3510_T0_00601; Mouser Part Number: 241-GBJ3510_T0_00601; Mouser Price/Stock: https://www.mouser.co.uk/ProductDetail/Panjit/GBJ3510_T0_00601?qs=tlsG%2FOw5FFggsibJfWBTvQ%3D%3D
C70 C71 C76 C86 C87 = UFW1V472MHD: Capacitor Polarised; Manufacturer_Name: Nichicon; Datasheet Link: https://www.nichicon.co.jp/english/products/pdfs/e-ufw.pdf; Height: 37.5mm; Manufacturer_Part_Number: UFW1V472MHD; Mouser Part Number: 647-UFW1V472MHD; Mouser Price/Stock: https://www.mouser.co.uk/ProductDetail/Nichicon/UFW1V472MHD?qs=kArNe9LFxXnJL9rvReZXrQ%3D%3D; Arrow Part Number: UFW1V472MHD; Arrow Price/Stock: https://www.arrow.com/en/products/ufw1v472mhd/nichicon
C74 C75 C77-C84 C88-C93 = Cap: Capacitor; Published: 8-Jun-2000; LatestRevisionDate: 17-Jul-2002; LatestRevisionNote: Re-released for DXP Platform.; PackageReference: RAD-0.3; Publisher: Altium Limited; PackageDescription: Radial Cap, Thru-Hole; 2 Leads; 0.3 in Pin Spacing
D1 D2 = CMP-12790-000001-1: DIODE SCHOTTKY 20V 3A SMA; Manufacturer: Diodes Inc.; Peak Reverse Current: 0.5mA; Standoff Height: 0.05mm; Automotive Grade: Grade 0; Max Surge Forward Current: 80A; Value: 200pF; Max Junction Temp: +150°C; ComponentLink2Description: Datasheet; Forward Current: 3A; Height: 2.4mm; Temperature: -55°C to +150°C; Automotive: Yes; Temperature Range Low: -55°C; Lead Free: Yes; Digikey Description: DIODE SCHOTTKY 20V 3A SMA; Temperature Range High: +150°C; Reverse Voltage: 20V; Device Class L2: Diodes; Capacitance: 200pF; Manufacturer Part Number: B320A-13-F; Device Class L1: Discrete Semiconductors; RoHS: TRUE; Footprint Url: https://www.diodes.com/assets/Package-Files/SMA.pdf; Package: SMA; Category: Diode; ComponentLink2URL: https://www.diodes.com/assets/Datasheets/B320A_B360A.pdf; Mouser Description: Schottky Diodes & Rectifiers 20V 3A; Octopart: https://octopart.com/b320a-13-f-diodes+inc.-325803; Device Class L3: Schottky Diodes; Max Repetitive Reverse Voltage: 20V
E1 = CMP-1559-01732-1: OMNIMATE Signal - series LM; Manufacturer: Weidmueller; Rated_voltage_use_group_B_UL_1059: 300 V; Short_text_for_material: LM 3.50/04/90 3.2SN OR BX; Wire_cross_section_AWG_min_UL_1059: AWG 28; Pitch_mm: 3,5 mm; Solder_pin_length_mm: 3,2 mm; Contact_material: Cu-Leg; Rated_current_min_no_of_poles_TU_20_deg_C: 19 A; Rated_current_use_group_B_UL_1059: 10 A; Side_termination_characteristic: closed side; Contact_surface: tinned; UL_94_flammability_rating: V-2; Pitch_inch: 0,138 inch; Insulating_material: PA; Solid_max_H05_07_V_U: 1,5 mm²; Rated_voltage_for_surge_voltage_class_pollution_degree_II_2: 320 V; Wire_cross_section_AWG_max_UL_1059: AWG 14; Mounting_onto_the_PCB: Solder connection; Solid_min_H05_07_V_U: 0,5 mm²; No_of_poles: 4; ComponentLink2Description: URL Link1; ComponentLink2URL: http://catalog.weidmueller.com/catalog/Start.do?localeId=en&ObjectID=1845040000; Qty: 100 PCS; Packaging: Box; Revision: V1; PartNumber: 1845040000; ComponentLink1Description: Manufacturer URL; ComponentLink1URL: http://www.weidmueller.com/; PackageReference: LM_3_5_90_04; Colour: Orange
IC6 IC7 = TPS54332DDA: Integrated Circuit; Manufacturer_Name: Texas Instruments; Datasheet Link: http://www.ti.com/lit/ds/symlink/tps54332.pdf; Height: 1.7mm; Manufacturer_Part_Number: TPS54332DDA; Mouser Part Number: 595-TPS54332DDA; Mouser Price/Stock: https://www.mouser.co.uk/ProductDetail/Texas-Instruments/TPS54332DDA?qs=uxmOeTEqoPwp5rNW7uC%2FUw%3D%3D; Arrow Part Number: TPS54332DDA; Arrow Price/Stock: https://www.arrow.com/en/products/tps54332dda/texas-instruments?region=nac
L8 L9 = 710-74437346025: SMD
LED9 LED10 = ELM70303GD: LED; Manufacturer_Name: Bivar; Datasheet Link: https://componentsearchengine.com/Datasheets/2/ELM70303GD.pdf; Height: 5.4mm; Manufacturer_Part_Number: ELM70303GD; Mouser Part Number: 749-ELM70303GD; Mouser Price/Stock: https://www.mouser.co.uk/ProductDetail/Bivar/ELM70303GD?qs=RaByzyhmEWg099B9bvH9wg%3D%3D
PSU_5V PSU_9V PSU_15V PSU_GND = CMP-2000-05299-1: Male Header, Pitch 2.54 mm, 1 x 2 Position, Height 9 mm, Tail Length 3.5 mm; Manufacturer: Phoenix Contact; Number of contacts: 2; Content: 250pc(s); Pitch: 2.54mm; Industrial packaging: Yes; Colour: Green; Manufacturer part No.: 1725656; Type: MPT0,5/2-2,54; Datasheet URL: http://datasheet.octopart.com/1725656-Phoenix-Contact-datasheet-5302866.pdf; Manufacturer URL: http://www.phoenixcontact.com/; Datasheet Version: Apr-08
R17 R21 R25 R27 R41-R50 SB_5V SB_9V SB_15V SB_15V2 = Res1: Resistor; Published: 8-Jun-2000; LatestRevisionDate: 17-Jul-2002; LatestRevisionNote: Re-released for DXP Platform.; PackageReference: AXIAL-0.3; Publisher: Altium Limited; PackageDescription: Axial Device, Thru-Hole; 2 Leads; 0.3 in Pin Spacing
RT1 = 5D2-18LCS: Thermistor; Manufacturer_Name: Semitec; Datasheet Link: https://www.mouser.com/datasheet/2/362/powerthermistor-4812.pdf; Height: 23mm; Manufacturer_Part_Number: 5D2-18LCS; Mouser Part Number: 954-5D2-18LCS; Mouser Price/Stock: https://www.mouser.co.uk/ProductDetail/Semitec/5D2-18LCS?qs=wgO0AD0o1vtBHDxl69yjSQ%3D%3D

## Sheet FrontIO.SchDoc
size A4; SheetNumber: 6; SheetTotal: 8
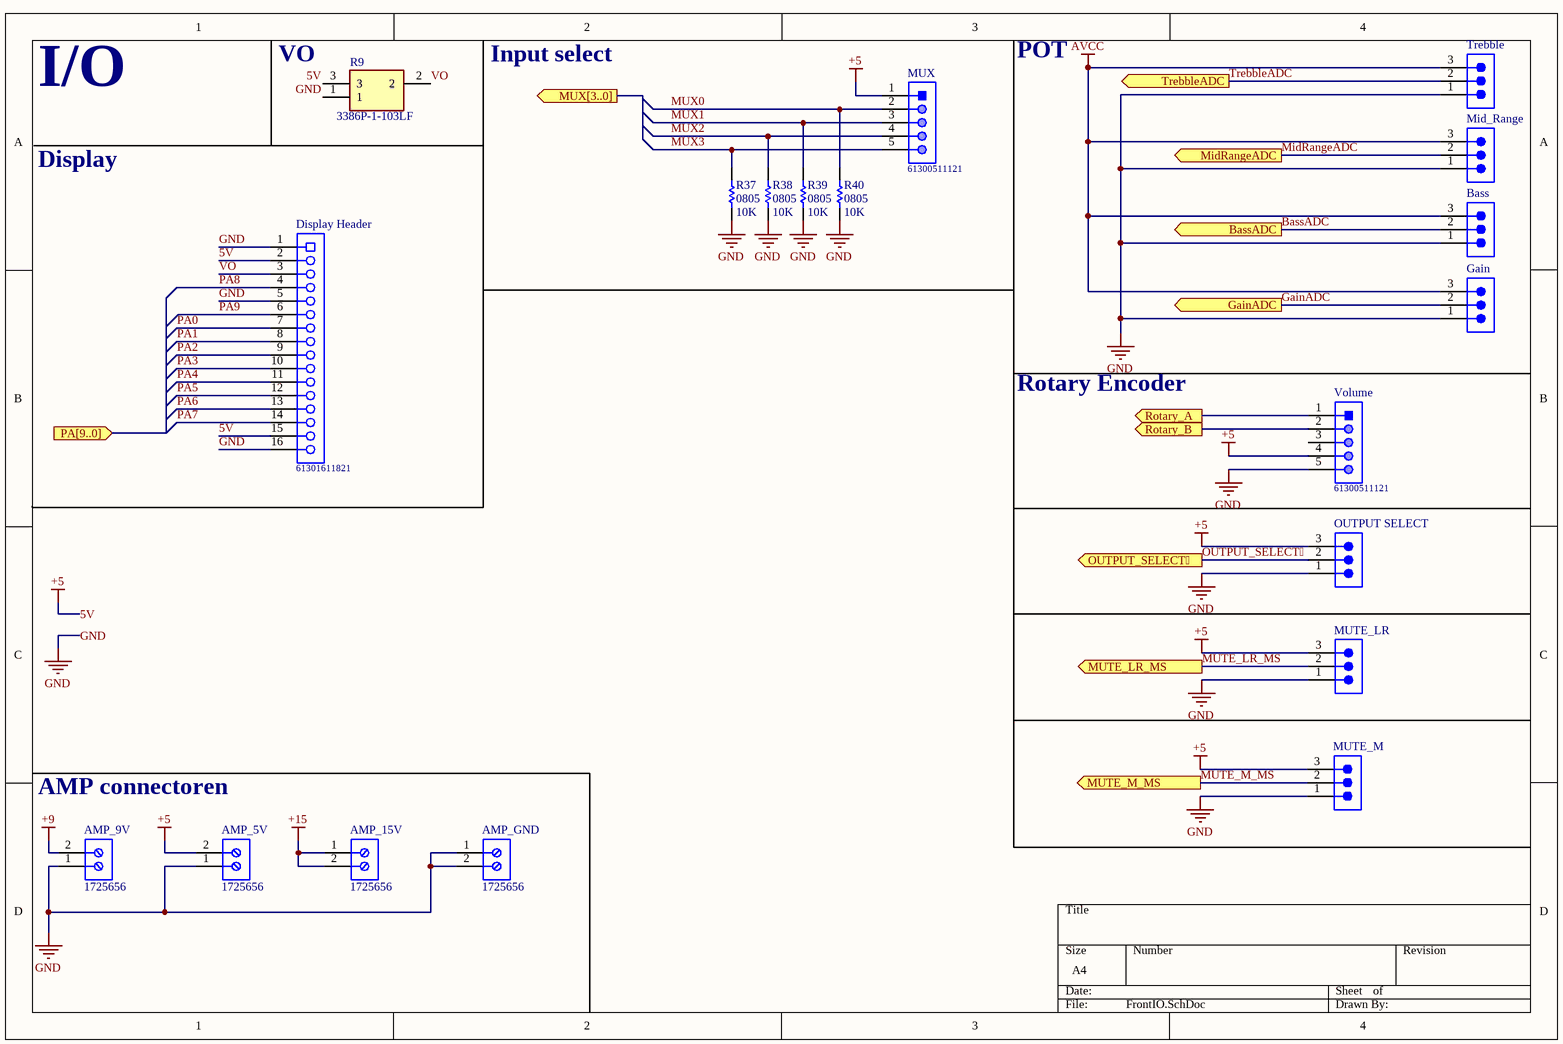
[diagram p5: FrontIO.SchDoc]

### Parts
AMP_5V  1725656  [PHOE-1725656-2]
AMP_9V  1725656  [PHOE-1725656-2]
AMP_15V  1725656  [PHOE-1725656-2]
AMP_GND  1725656  [PHOE-1725656-2]
Bass  TSW-103-07-F-S  [SMTC-TSW-103-07-X-S]  (value not drawn)
Display_Header  61301611821  [61301611821]
Gain  TSW-103-07-F-S  [SMTC-TSW-103-07-X-S]  (value not drawn)
Mid_Range  TSW-103-07-F-S  [SMTC-TSW-103-07-X-S]  (value not drawn)
MUTE_LR  TSW-103-07-F-S  [SMTC-TSW-103-07-X-S]  (value not drawn)
MUTE_M  TSW-103-07-F-S  [SMTC-TSW-103-07-X-S]  (value not drawn)
MUX  61300511121  [61300511121]
OUTPUT_SELECT  TSW-103-07-F-S  [SMTC-TSW-103-07-X-S]  (value not drawn)
R9  3386P-1-103LF  [3386P_1]
R37  0805  value 10K  [6-0805_N]
R38  0805  value 10K  [6-0805_N]
R39  0805  value 10K  [6-0805_N]
R40  0805  value 10K  [6-0805_N]
Trebble  TSW-103-07-F-S  [SMTC-TSW-103-07-X-S]  (value not drawn)
Volume  61300511121  [61300511121]

### Ports
BassADC (out, see Main[3C], ATtiny[3B]), GainADC (out, see Main[3C], ATtiny[3B]), MidRangeADC (out, see Main[3C], ATtiny[3B]), MUTE_LR_MS (out, see Main[4C], AnalogSwitch[3A]), MUTE_M_MS (out, see Main[4C], AnalogSwitch[3B]), MUX[3..0] (out, see Main[3C], ATtiny[1B]), OUTPUT_SELECT (out, see Main[3D], AnalogSwitch[1B]), PA[9..0] (in, see Main[3C], ATtiny[3C]), Rotary_A (out, see Main[3D], ATtiny[3B]), Rotary_B (out, see Main[3D], ATtiny[3B]), TrebbleADC (out, see Main[3C], ATtiny[3B])

### Nets
5V: AMP_5V.2 Display_Header.2 Display_Header.15 MUTE_LR.3 MUTE_M.3 MUX.1 OUTPUT_SELECT.3 R9.3 Volume.4  [also labelled +5]
+9: AMP_9V.2
+15: AMP_15V.1 AMP_15V.2
AVCC: Bass.3 Gain.3 Mid_Range.3 Trebble.3
GND: AMP_5V.1 AMP_9V.1 AMP_GND.1 AMP_GND.2 Bass.1 Display_Header.1 Display_Header.5 Display_Header.16 Gain.1 Mid_Range.1 MUTE_LR.1 MUTE_M.1 OUTPUT_SELECT.1 R9.1 R37.1 R38.1 R39.1 R40.1 Trebble.1 Volume.5
BassADC: Bass.2 ; port BassADC
GainADC: Gain.2 ; port GainADC
MidRangeADC: Mid_Range.2 ; port MidRangeADC
MUTE_LR_MS: MUTE_LR.2 ; port MUTE_LR_MS
MUTE_M_MS: MUTE_M.2 ; port MUTE_M_MS
MUX0: MUX.2 R40.2
MUX1: MUX.3 R39.2
MUX2: MUX.4 R38.2
MUX3: MUX.5 R37.2
OUTPUT_SELECT: OUTPUT_SELECT.2 ; port OUTPUT_SELECT
PA0: Display_Header.7
PA1: Display_Header.8
PA2: Display_Header.9
PA3: Display_Header.10
PA4: Display_Header.11
PA5: Display_Header.12
PA6: Display_Header.13
PA7: Display_Header.14
PA8: Display_Header.4
PA9: Display_Header.6
Rotary_N: Volume.2 ; port Rotary_B
Rotary_P: Volume.1 ; port Rotary_A
TrebbleADC: Trebble.2 ; port TrebbleADC
VO: Display_Header.3 R9.2

Not connected (* = marked no-connect by the designer): Volume 3

### Notes on the sheet
- I/O
- (near R9) VO
- Input select
- POT
- Display
- Rotary Encoder
- AMP connectoren

### Library data of the parts
AMP_5V AMP_9V AMP_15V AMP_GND = CMP-2000-05299-1: as PSU_5V on sheet PSU; Colour: Green; Manufacturer part No.: 1725656; Type: MPT0,5/2-2,54; Datasheet URL: http://datasheet.octopart.com/1725656-Phoenix-Contact-datasheet-5302866.pdf; Manufacturer URL: http://www.phoenixcontact.com/; Datasheet Version: Apr-08
Bass Gain Mid_Range MUTE_LR MUTE_M OUTPUT_SELECT Trebble = CMP-1024-00331-1: as INPUT1 on sheet TDA7439DS; DatasheetVersion: F-214; ComponentLink1Description: Manufacturer URL; ComponentLink3URL: http://www.samtec.com/documents/webfiles/cpdf/TSW-XXX-XX-XXX-X-XX-XXX-MKT.pdf; Mounting Technology: Through-hole; PackageDescription: .025[0.64] SQ. Post Terminal Strip Assembly; Temperature Range: -55 to 125 degC; ComponentLink3Description: Package Specification; Orientation: Vertical; PartNumber: TSW-103-07-F-S; RoHS: True; PackageVersion: DM, 8/1988; ComponentLink2Description: Datasheet; ComponentLink1URL: http://www.samtec.com; ComponentLink2URL: http://www.samtec.com/documents/webfiles/pdf/TSW_TH.PDF; PackageReference: TSW-103-07-X-S
Display_Header = CMP-1502-01343-1: THT Vertical Socket Header WR-PHD, Pitch 2.54 mm, Single Row, 16 pins; Manufacturer: Wurth Elektronik; Working Voltage: 250VAC; Pin Number: 16; Gender: Female; Withstanding Voltage: 500VAC; Rated Current: 3A; Contact Resistance: 20mOhm; Pitch: 2.54mm; Operating Temperature: -40to125degC; Manufacturer URL: http://www.we-online.de; Mounting Technology: THT; Part Number: 61301611821; Datasheet URL: https://katalog.we-online.de/em/datasheet/6130xx11821.pdf; Publisher: WurthElektronik; Row Number: Single; Orientation: Vertical; Packaging: Tray; Package Reference: 61301611821
MUX Volume = CMP-1502-01068-1: THT Vertical Pin Header WR-PHD, Pitch 2.54 mm, Single Row, 5 pins; Manufacturer: Wurth Elektronik; Pin Number: 5; Contact Resistance: 20mOhm; Working Voltage: 250VAC; Pitch: 2.54mm; Withstanding Voltage: 500VAC; Rated Current: 3A; Gender: Male; Datasheet URL: https://katalog.we-online.de/em/datasheet/6130xx11121.pdf; Orientation: Vertical; Mounting Technology: THT; Row Number: Single; Package Reference: 61300511121; Publisher: WurthElektronik; Part Number: 61300511121; Packaging: Bag; Manufacturer URL: http://www.we-online.de; Operating Temperature: -40to105degC
R9 = 3386P-1-103LF: Resistor; Manufacturer_Name: Bourns; Datasheet Link: https://www.bourns.com/pdfs/3386.pdf; Manufacturer_Part_Number: 3386P-1-103LF; Mouser Part Number: 652-3386P-1-103LF; Mouser Price/Stock: https://www.mouser.co.uk/ProductDetail/Bourns/3386P-1-103LF?qs=m2uG%2FFdTAPWTJ6kNGJOVuA%3D%3D; Arrow Part Number: 3386P-1-103LF; Arrow Price/Stock: https://www.arrow.com/en/products/3386p-1-103lf/bourns?region=europe
R37-R40 = Res1: Resistor; Published: 8-Jun-2000; LatestRevisionDate: 17-Jul-2002; LatestRevisionNote: Re-released for DXP Platform.; PackageReference: AXIAL-0.3; Publisher: Altium Limited; PackageDescription: Axial Device, Thru-Hole; 2 Leads; 0.3 in Pin Spacing

## Sheet TPA_MONO.SchDoc
size A4; SheetNumber: 7; SheetTotal: 8
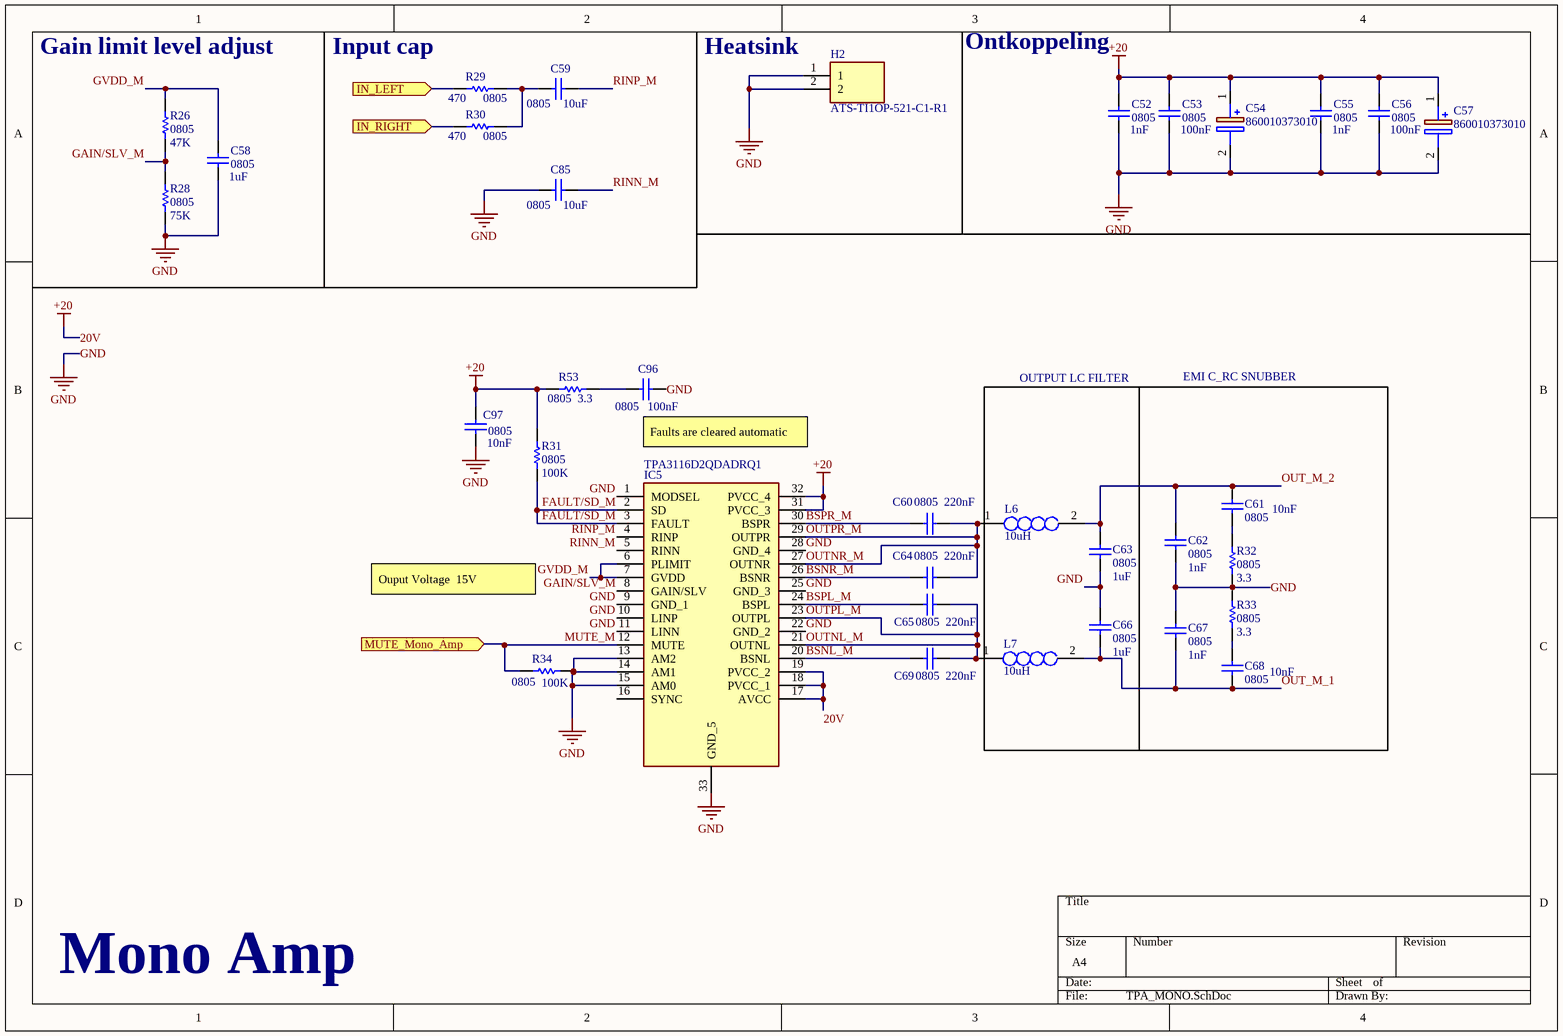
[diagram p6: TPA_MONO.SchDoc]

### Parts
C52  0805  value 1nF  [6-0805_N]
C53  0805  value 100nF  [6-0805_N]
C54  860010373010  [CAPPRD250W52D630H1250]
C55  0805  value 1nF  [6-0805_N]
C56  0805  value 100nF  [6-0805_N]
C57  860010373010  [CAPPRD250W52D630H1250]
C58  0805  value 1uF  [6-0805_N]
C59  0805  value 10uF  [6-0805_N]
C60  0805  value 220nF  [6-0805_N]
C61  0805  value 10nF  [6-0805_N]
C62  0805  value 1nF  [6-0805_N]
C63  0805  value 1uF  [6-0805_N]
C64  0805  value 220nF  [6-0805_N]
C65  0805  value 220nF  [6-0805_N]
C66  0805  value 1uF  [6-0805_N]
C67  0805  value 1nF  [6-0805_N]
C68  0805  value 10nF  [6-0805_N]
C69  0805  value 220nF  [6-0805_N]
C85  0805  value 10uF  [6-0805_N]
C96  0805  value 100nF  [6-0805_N]
C97  0805  value 10nF  [6-0805_N]
H2  ATS-TI1OP-521-C1-R1  [ATSTI1OP521C1R1]
IC5  TPA3116D2QDADRQ1  [SOP65P810X120-33N]
L6  10uH  [INDPM110100X400N]
L7  10uH  [INDPM110100X400N]
R26  0805  value 47K  [6-0805_N]
R28  0805  value 75K  [6-0805_N]
R29  0805  value 470  [6-0805_N]
R30  0805  value 470  [6-0805_N]
R31  0805  value 100K  [6-0805_N]
R32  0805  value 3.3  [6-0805_N]
R33  0805  value 3.3  [6-0805_N]
R34  0805  value 100K  [6-0805_N]
R53  0805  value 3.3  [6-0805_N]

### Blocks framed on the sheet
OUTPUT LC FILTER: C63 C66 L6 L7
EMI C_RC SNUBBER: C61 C62 C67 C68 R32 R33

### Ports
IN_LEFT (in, see Main[3B]), IN_RIGHT (in, see Main[3B]), MUTE_Mono_Amp (in, see Main[3B], AnalogSwitch[3B])

### Nets
20V: C52.1 C53.1 C54.1(+) C55.1 C56.1 C57.1(+) C97.1 IC5.17(AVCC) IC5.18(PVCC_1) IC5.19(PVCC_2) IC5.31(PVCC_3) IC5.32(PVCC_4) R31.2 R53.2  [also labelled +20]
GND: C52.2 C53.2 C54.2(-) C55.2 C56.2 C57.2(-) C58.2 C62.1 C63.1 C66.2 C67.2 C85.1 C96.2 C97.2 H2.1 H2.2 IC5.1(MODSEL) IC5.9(GND_1) IC5.10(LINP) IC5.11(LINN) IC5.13(AM2) IC5.14(AM1) IC5.15(AM0) IC5.22(GND_2) IC5.25(GND_3) IC5.28(GND_4) IC5.33(GND_5) R28.1 R32.1 R33.2 R34.1
BSNL_M: C69.1 IC5.20(BSNL)
BSNR_M: C64.1 IC5.26(BSNR)
BSPL_M: C65.1 IC5.24(BSPL)
BSPR_M: C60.1 IC5.30(BSPR)
FAULT/SD_M: IC5.2(SD) IC5.3(FAULT) R31.1
GAIN/SLV_M: IC5.8(GAIN/SLV) R26.1 R28.2
GVDD_M: C58.1 IC5.6(PLIMIT) IC5.7(GVDD) R26.2
IN_LEFT_M: R29.2 ; port IN_LEFT
IN_RIGHT_M: R30.2 ; port IN_RIGHT
MUTE_M: IC5.12(MUTE) R34.2 ; port MUTE_Mono_Amp
OUT_M_1: C66.1 C67.1 C68.1 L7.2
OUT_M_2: C61.2 C62.2 C63.2 L6.2
OUTNL_M: C65.2 C69.2 IC5.21(OUTNL) IC5.23(OUTPL) L7.1  [also labelled OUTPL_M]
OUTNR_M: C60.2 C64.2 IC5.27(OUTNR) IC5.29(OUTPR) L6.1  [also labelled OUTPR_M]
RINN_M: C85.2 IC5.5(RINN)
RINP_M: C59.2 IC5.4(RINP)
NetC59_1: C59.1 R29.1 R30.1
NetC61_1: C61.1 R32.2
NetC68_2: C68.2 R33.1
NetC96_1: C96.1 R53.1

Not connected (* = marked no-connect by the designer): IC5 16(SYNC)

### Notes on the sheet
- (near R26) Gain limit level adjust
- (near R29) Input cap
- (near H2) Heatsink
- Ontkoppeling
- (near C96) Faults are cleared automatic
- Ouput Voltage  15V
- Mono Amp

### Library data of the parts
C52 C53 C55 C56 C58-C69 C85 C96 C97 = Cap: Capacitor; Published: 8-Jun-2000; LatestRevisionDate: 17-Jul-2002; LatestRevisionNote: Re-released for DXP Platform.; PackageReference: RAD-0.3; Publisher: Altium Limited; PackageDescription: Radial Cap, Thru-Hole; 2 Leads; 0.3 in Pin Spacing
C54 C57 = 860010373010: as C16 on sheet TPA_LR; Datasheet Link: https://ms.componentsearchengine.com/Datasheets/2/860010373010.pdf; Height: 12.5mm; Manufacturer_Part_Number: 860010373010; Mouser Part Number: 710-860010373010; Mouser Price/Stock: https://www.mouser.com/Search/Refine.aspx?Keyword=710-860010373010
H2 = ATS-TI1OP-521-C1-R1: as H1 on sheet TPA_LR; Datasheet Link: https://media.digikey.com/pdf/Data%20Sheets/Advanced%20Thermal%20Solutions%20PDFs/ATS-TI10P-521-C1-R1.pdf; Height: 28mm; Manufacturer_Part_Number: ATS-TI1OP-521-C1-R1; Mouser Part Number: 984-ATS-TI1OP521C1R1; Mouser Price/Stock: https://www.mouser.co.uk/ProductDetail/Advanced-Thermal-Solutions/ATS-TI1OP-521-C1-R1?qs=MLItCLRbWsx43HjcCreTeQ%3D%3D; Arrow Part Number: ATS-TI1OP-521-C1-R1; Arrow Price/Stock: https://www.arrow.com/en/products/ats-ti1op-521-c1-r1/advanced-thermal-solutions?region=europe
IC5 = TPA3116D2QDADRQ1: as IC3 on sheet TPA_LR; Datasheet Link: http://www.ti.com/lit/gpn/tpa3116d2-q1; Height: 1.2mm; Manufacturer_Part_Number: TPA3116D2QDADRQ1; Mouser Part Number: 595-TPA3116D2QDADRQ1; Mouser Price/Stock: https://www.mouser.co.uk/ProductDetail/Texas-Instruments/TPA3116D2QDADRQ1?qs=UPLqB4C8V4HphPtdRa3LzQ%3D%3D; Arrow Part Number: TPA3116D2QDADRQ1; Arrow Price/Stock: https://www.arrow.com/en/products/tpa3116d2qdadrq1/texas-instruments?region=nac
L6 L7 = SRP1038A-4R7M: Inductor; Manufacturer_Name: Bourns; Datasheet Link: http://uk.rs-online.com/web/p/products/8193346; Height: 4mm; Manufacturer_Part_Number: SRP1038A-4R7M; Mouser Part Number: 652-SRP1038A-4R7M; Mouser Price/Stock: https://www.mouser.co.uk/ProductDetail/Bourns/SRP1038A-4R7M/?qs=7z%252BmIopC6%2FImcvZmY6cLew%3D%3D; Arrow Part Number: SRP1038A-4R7M; Arrow Price/Stock: https://www.arrow.com/en/products/srp1038a-4r7m/bourns?region=nac
R26 R28-R34 R53 = Res1: Resistor; Published: 8-Jun-2000; LatestRevisionDate: 17-Jul-2002; LatestRevisionNote: Re-released for DXP Platform.; PackageReference: AXIAL-0.3; Publisher: Altium Limited; PackageDescription: Axial Device, Thru-Hole; 2 Leads; 0.3 in Pin Spacing

## Sheet AnalogSwitch.SchDoc
size A4; SheetNumber: 8; SheetTotal: 8
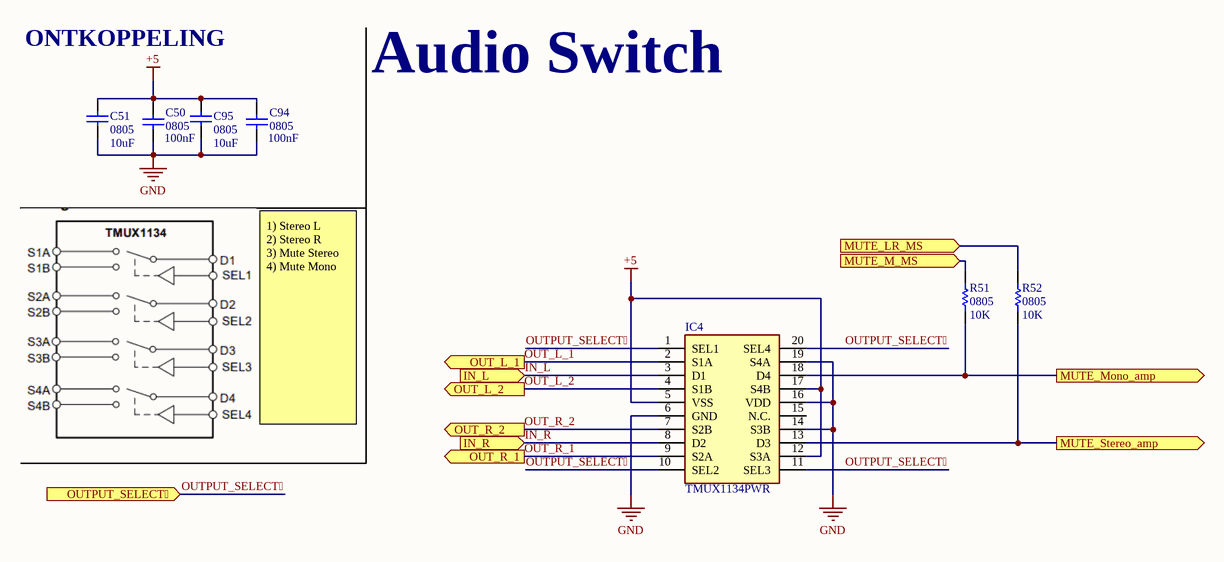
[diagram p7: AnalogSwitch.SchDoc]

### Parts
C50  0805  value 100nF  [6-0805_N]
C51  0805  value 10uF  [6-0805_N]
C94  0805  value 100nF  [6-0805_N]
C95  0805  value 10uF  [6-0805_N]
IC4  TMUX1134PWR  [SOP65P640X120-20N]
R51  0805  value 10K  [6-0805_N]
R52  0805  value 10K  [6-0805_N]

### Ports
IN_L (in, see Main[2A]), IN_R (in, see Main[2A]), MUTE_LR_MS (in, see Main[2A], FrontIO[3C]), MUTE_M_MS (in, see Main[2B], FrontIO[3D]), MUTE_Mono_amp (out, see Main[2B], TPA_MONO[1C]), MUTE_Stereo_amp (out, see Main[2B], TPA_LR[1C]), OUT_L_1 (out, see Main[2A]), OUT_L_2 (out, see Main[2B]), OUT_R_1 (out, see Main[2A]), OUT_R_2 (out, see Main[2B]), OUTPUT_SELECT (in, see Main[2B], FrontIO[3C])

### Nets
+5: C50.1 C51.1 C94.1 C95.1 IC4.5(VSS) IC4.12(S3A) IC4.17(S4B)  [project net 5V]
GND: C50.2 C51.2 C94.2 C95.2 IC4.6(GND) IC4.14(S3B) IC4.16(VDD) IC4.19(S4A)
IN_L: IC4.3(D1) ; port IN_L
IN_R: IC4.8(D2) ; port IN_R
MUTE: IC4.13(D3) R52.1 ; port MUTE_Stereo_amp
MUTE_LR_MS: R52.2 ; port MUTE_LR_MS
MUTE_M: IC4.18(D4) R51.1 ; port MUTE_Mono_amp
MUTE_M_MS: R51.2 ; port MUTE_M_MS
OUT_L_1: IC4.2(S1A) ; port OUT_L_1  [project net IN_LEFT]
OUT_L_2: IC4.4(S1B) ; port OUT_L_2  [project net IN_LEFT_M]
OUT_R_1: IC4.9(S2A) ; port OUT_R_1  [project net IN_RIGHT]
OUT_R_2: IC4.7(S2B) ; port OUT_R_2  [project net IN_RIGHT_M]
OUTPUT_SELECT: IC4.1(SEL1) IC4.10(SEL2) IC4.11(SEL3) IC4.20(SEL4) ; port OUTPUT_SELECT

Not connected (* = marked no-connect by the designer): IC4 15(N.C.)

### Notes on the sheet
- ONTKOPPELING
- Audio Switch
- 1) Stereo L
  2) Stereo R
  3) Mute Stereo
  4) Mute Mono

### Library data of the parts
C50 C51 C94 C95 = Cap: Capacitor; Published: 8-Jun-2000; LatestRevisionDate: 17-Jul-2002; LatestRevisionNote: Re-released for DXP Platform.; PackageReference: RAD-0.3; Publisher: Altium Limited; PackageDescription: Radial Cap, Thru-Hole; 2 Leads; 0.3 in Pin Spacing
IC4 = TMUX1134PWR: Integrated Circuit; Manufacturer_Name: Texas Instruments; Datasheet Link: https://www.ti.com/lit/gpn/TMUX1134; Height: 1.2mm; Manufacturer_Part_Number: TMUX1134PWR; Mouser Part Number: 595-TMUX1134PWR; Mouser Price/Stock: https://www.mouser.co.uk/ProductDetail/Texas-Instruments/TMUX1134PWR?qs=%252B6g0mu59x7L8VGQncKsYmQ%3D%3D; Arrow Part Number: TMUX1134PWR; Arrow Price/Stock: https://www.arrow.com/en/products/tmux1134pwr/texas-instruments?region=nac
R51 R52 = Res1: Resistor; Published: 8-Jun-2000; LatestRevisionDate: 17-Jul-2002; LatestRevisionNote: Re-released for DXP Platform.; PackageReference: AXIAL-0.3; Publisher: Altium Limited; PackageDescription: Axial Device, Thru-Hole; 2 Leads; 0.3 in Pin Spacing

## Nets that join several sheets
5V: Main (R35.2 R36.2), ATtiny (13 pins), PSU (PSU_5V.1 R49.1 SB_5V.1), FrontIO (9 pins), AnalogSwitch (7 pins)
20V: TPA_LR (14 pins), PSU (12 pins), TPA_MONO (14 pins)
+9: TDA7439DS (IC2.24), PSU (PSU_9V.1 R50.1 SB_9V.2), FrontIO (AMP_9V.2)
AVCC: ATtiny (C21.1 IC1.18 L1.2), FrontIO (Bass.3 Gain.3 Mid_Range.3 Trebble.3)
GND: ATtiny (6 pins), TDA7439DS (13 pins), TPA_LR (36 pins), PSU (38 pins), FrontIO (20 pins), TPA_MONO (31 pins), AnalogSwitch (8 pins)
BassADC: ATtiny (IC1.22), FrontIO (Bass.2)
GainADC: ATtiny (IC1.17), FrontIO (Gain.2)
IN_L: TDA7439DS (IC2.27), AnalogSwitch (IC4.3)
IN_LEFT: TPA_LR (C48.1), AnalogSwitch (IC4.2)
IN_LEFT_M: TPA_MONO (R29.2), AnalogSwitch (IC4.4)
IN_R: TDA7439DS (IC2.26), AnalogSwitch (IC4.8)
IN_RIGHT: TPA_LR (C49.1), AnalogSwitch (IC4.9)
IN_RIGHT_M: TPA_MONO (R30.2), AnalogSwitch (IC4.7)
MidRangeADC: ATtiny (IC1.23), FrontIO (Mid_Range.2)
MUTE: TPA_LR (IC3.12 R23.2), AnalogSwitch (IC4.13 R52.1)
MUTE_LR_MS: FrontIO (MUTE_LR.2), AnalogSwitch (R52.2)
MUTE_M: TPA_MONO (IC5.12 R34.2), AnalogSwitch (IC4.18 R51.1)
MUTE_M_MS: FrontIO (MUTE_M.2), AnalogSwitch (R51.2)
OUTPUT_SELECT: FrontIO (OUTPUT_SELECT.2), AnalogSwitch (IC4.1 IC4.10 IC4.11 IC4.20)
Rotary_N: ATtiny (IC1.20), FrontIO (Volume.2)
Rotary_P: ATtiny (IC1.19), FrontIO (Volume.1)
SCL: Main (R36.1), ATtiny (IC1.26), TDA7439DS (IC2.21)
SDA: Main (R35.1), ATtiny (IC1.25), TDA7439DS (IC2.22)
TrebbleADC: ATtiny (IC1.24), FrontIO (Trebble.2)